# EAGLE design Pure Sequencer (EAGLE 9.6.2)

## Sheet 1 of 5
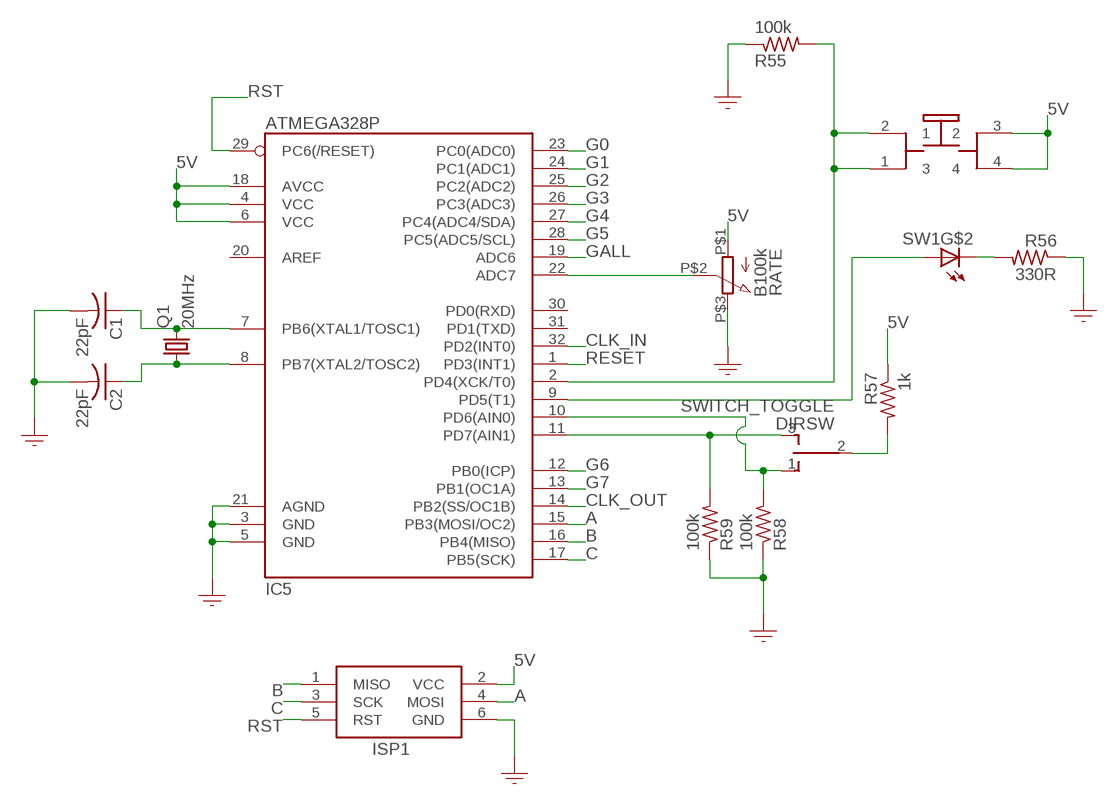
[diagram p0: schematic, sheet 1]

### Parts
C1  22pF  CAPACITOR-USC0805  [C0805]
C2  22pF  CAPACITOR-USC0805  [C0805]
DIRSW  SWITCH_TOGGLE  [TOGGLE_SW]
IC5  ATMEGA328P  MICROPROCESSOR_ATMEGA328_SMT  [TQFP32-08]
ISP1  HEADER2X3-6  [AVRISP]
Q1  20MHz  CRYSTALHC49UP  [HC49UP]
R55  100k  RESISTOR_USR0805  [R0805]
R56  330R  RESISTOR_USR0805  [R0805]
R57  1k  RESISTOR_USR0805  [R0805]
R58  100k  RESISTOR_USR0805  [R0805]
R59  100k  RESISTOR_USR0805  [R0805]
RATE  B100k  RESISTOR_VARIABLE9MM_POT  [POTENTIOMETER_9MM]
SW1  SWITCH_PUSHBUTTON_LED  [PB6149L]

### Nets
5V: IC5.4(VCC) IC5.6(VCC) IC5.18(AVCC) ISP1.2(VCC) R57.1 RATE.P$1 SW1.3 SW1.4 ; also sheet 2,4,5
A: IC5.15(PB3(MOSI/OC2)) ISP1.4(MOSI) ; also sheet 2
B: IC5.16(PB4(MISO)) ISP1.1(MISO) ; also sheet 2
C: IC5.17(PB5(SCK)) ISP1.3(SCK) ; also sheet 2
CLK_IN: IC5.32(PD2(INT0)) ; also sheet 4
CLK_OUT: IC5.14(PB2(SS/OC1B)) ; also sheet 4
G0: IC5.23(PC0(ADC0)) ; also sheet 3
G1: IC5.24(PC1(ADC1)) ; also sheet 3
G2: IC5.25(PC2(ADC2)) ; also sheet 3
G3: IC5.26(PC3(ADC3)) ; also sheet 3
G4: IC5.27(PC4(ADC4/SDA)) ; also sheet 3
G5: IC5.28(PC5(ADC5/SCL)) ; also sheet 3
G6: IC5.12(PB0(ICP)) ; also sheet 3
G7: IC5.13(PB1(OC1A)) ; also sheet 3
GALL: IC5.19(ADC6)
GND: C1.2 C2.2 IC5.3(GND) IC5.5(GND) IC5.21(AGND) ISP1.6(GND) R55.1 R56.1 R58.1 R59.1 RATE.P$3 ; also sheet 2,3,4,5
N$1: C1.1 IC5.7(PB6(XTAL1/TOSC1)) Q1.2
N$2: C2.1 IC5.8(PB7(XTAL2/TOSC2)) Q1.1
N$30: IC5.22(ADC7) RATE.P$2
N$63: IC5.2(PD4(XCK/T0)) R55.2 SW1.1 SW1.2
N$64: IC5.9(PD5(T1)) SW1.A
N$65: R56.2 SW1.K(C)
N$66: DIRSW.2(P) R57.2
N$67: DIRSW.1(O) IC5.10(PD6(AIN0)) R58.2
N$68: DIRSW.3(S) IC5.11(PD7(AIN1)) R59.2
RESET: IC5.1(PD3(INT1)) ; also sheet 4
RST: IC5.29(PC6(/RESET)) ISP1.5(RST)
Unconnected: IC5.20(AREF) IC5.30(PD0(RXD)) IC5.31(PD1(TXD))

## Sheet 2 of 5
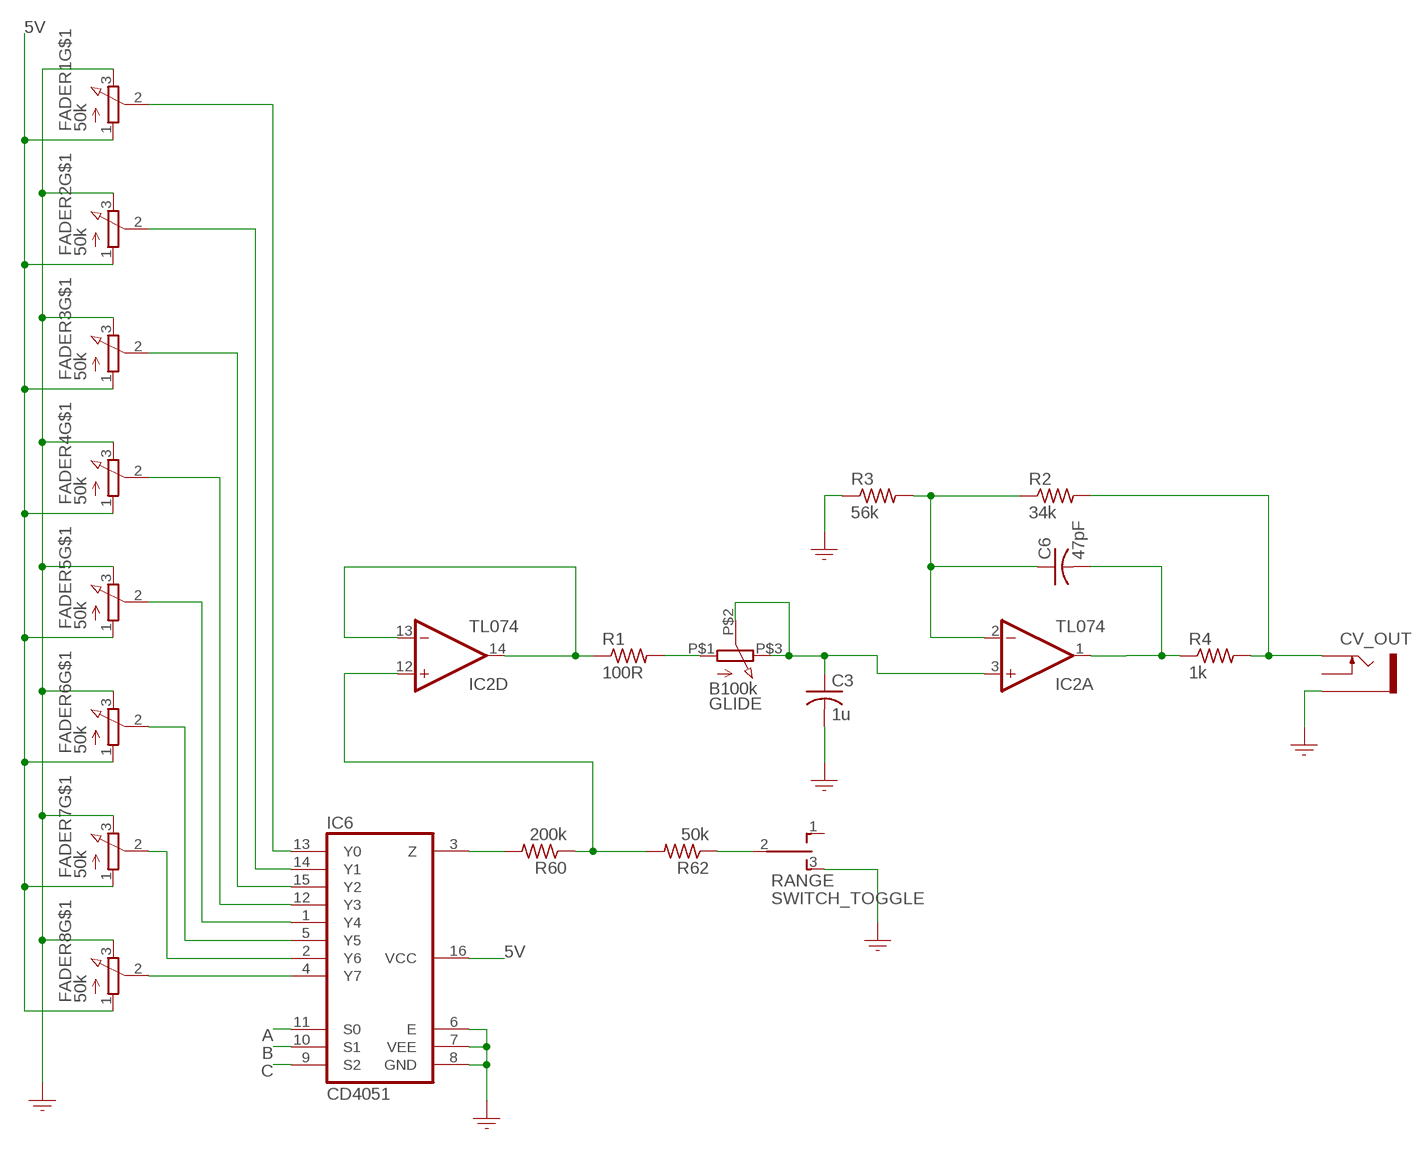
[diagram p1: schematic, sheet 2]

### Parts
C3  1u  CAPACITOR-USC0805  [C0805]
C6  47pF  CAPACITOR-USC0805  [C0805]
CV_OUT  PJ301M-12  SOCKET_MONO_3.5MMPJ301M-12  [PJ301M-12]
FADER1  50k  RESISTOR_VARIABLE_LED  [FADER_20MM_LED]
FADER2  50k  RESISTOR_VARIABLE_LED  [FADER_20MM_LED]
FADER3  50k  RESISTOR_VARIABLE_LED  [FADER_20MM_LED]
FADER4  50k  RESISTOR_VARIABLE_LED  [FADER_20MM_LED]
FADER5  50k  RESISTOR_VARIABLE_LED  [FADER_20MM_LED]
FADER6  50k  RESISTOR_VARIABLE_LED  [FADER_20MM_LED]
FADER7  50k  RESISTOR_VARIABLE_LED  [FADER_20MM_LED]
FADER8  50k  RESISTOR_VARIABLE_LED  [FADER_20MM_LED]
GLIDE  B100k  RESISTOR_VARIABLE9MM_POT  [POTENTIOMETER_9MM]
IC2  TL074  OPAMP_QUADD  [SO14]
IC6  CD4051  MUX_1X8_CD4051  [SOIC_16]
R1  100R  RESISTOR_USR0805  [R0805]
R2  34k  RESISTOR_USR0805  [R0805]
R3  56k  RESISTOR_USR0805  [R0805]
R4  1k  RESISTOR_USR0805  [R0805]
R60  200k  RESISTOR_USR0805  [R0805]
R62  50k  RESISTOR_USR0805  [R0805]
RANGE  SWITCH_TOGGLE  [TOGGLE_SW]

### Nets
5V: FADER1.1 FADER2.1 FADER3.1 FADER4.1 FADER5.1 FADER6.1 FADER7.1 FADER8.1 IC6.16(VCC) ; also sheet 1,4,5
A: IC6.11(S0) ; also sheet 1
B: IC6.10(S1) ; also sheet 1
C: IC6.9(S2) ; also sheet 1
GND: C3.2 CV_OUT.GND(SLEEVE) FADER1.3 FADER2.3 FADER3.3 FADER4.3 FADER5.3 FADER6.3 FADER7.3 FADER8.3 IC6.6(E) IC6.7(VEE) IC6.8(GND) R3.1 RANGE.3(S) ; also sheet 1,3,4,5
N$3: IC2.12(D:+IN) R60.1 R62.2
N$4: IC2.13(D:-IN) IC2.14(D:OUT) R1.1
N$5: GLIDE.P$1 R1.2
N$6: FADER8.2 IC6.4(Y7)
N$7: FADER7.2 IC6.2(Y6)
N$8: FADER6.2 IC6.5(Y5)
N$11: FADER5.2 IC6.1(Y4)
N$12: FADER4.2 IC6.12(Y3)
N$13: FADER3.2 IC6.15(Y2)
N$14: FADER2.2 IC6.14(Y1)
N$15: FADER1.2 IC6.13(Y0)
N$16: C3.1 GLIDE.P$2 GLIDE.P$3 IC2.3(A:+IN)
N$19: C6.1 IC2.2(A:-IN) R2.1 R3.2
N$20: C6.2 IC2.1(A:OUT) R4.1
N$21: CV_OUT.TIP R2.2 R4.2
N$69: IC6.3(Z) R60.2
N$70: R62.1 RANGE.2(P)
Unconnected: CV_OUT.NORM(SWITCH) RANGE.1(O)

## Sheet 3 of 5
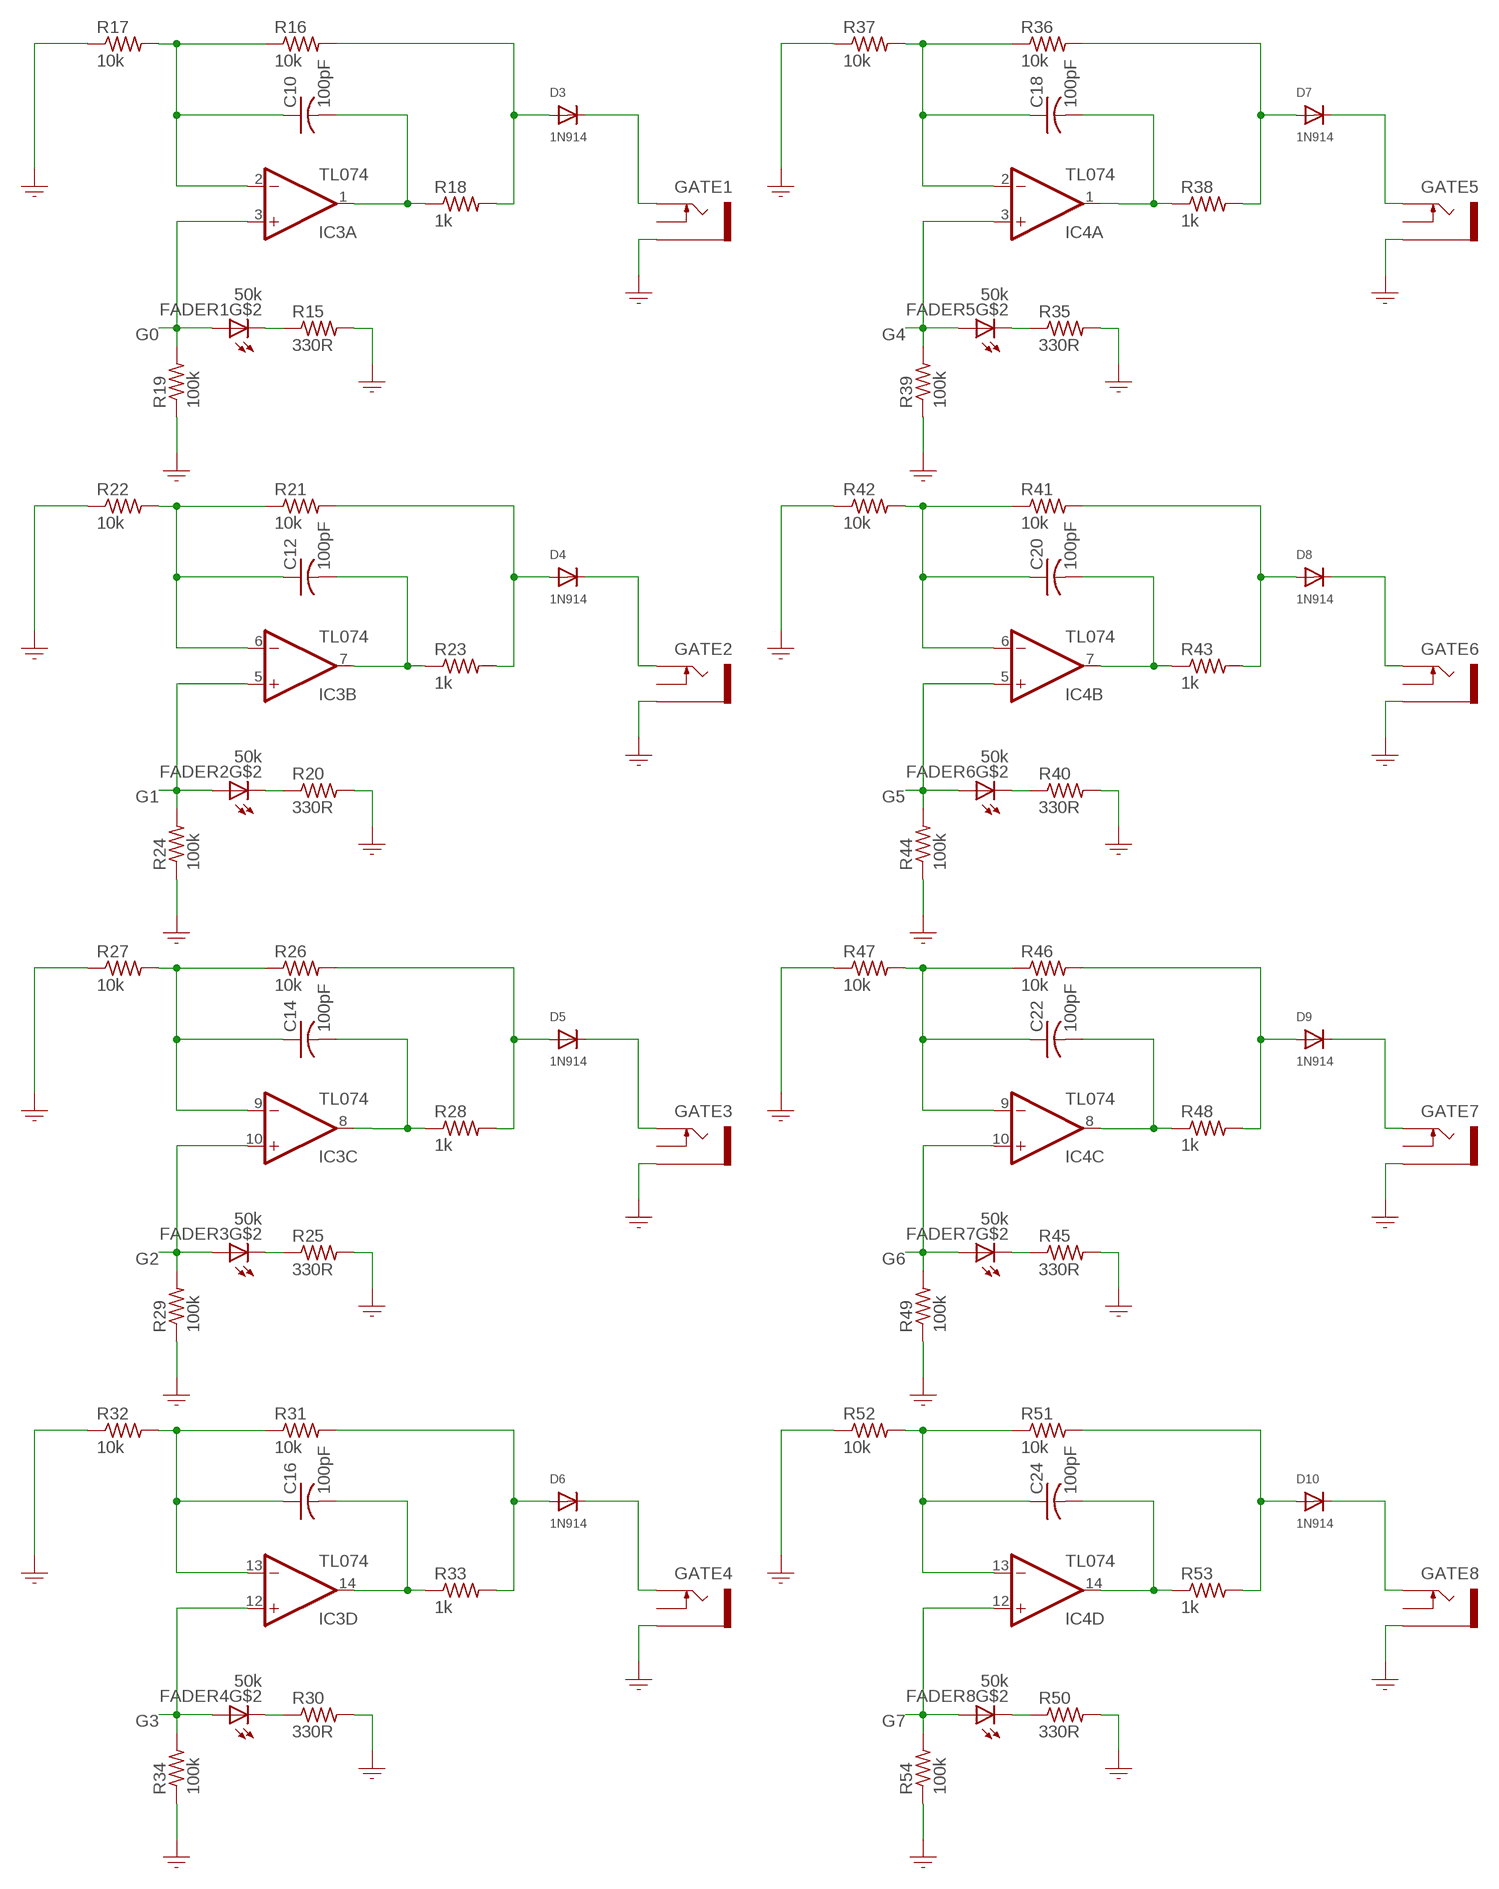
[diagram p2: schematic, sheet 3]

### Parts
C10  100pF  CAPACITOR-USC0805  [C0805]
C12  100pF  CAPACITOR-USC0805  [C0805]
C14  100pF  CAPACITOR-USC0805  [C0805]
C16  100pF  CAPACITOR-USC0805  [C0805]
C18  100pF  CAPACITOR-USC0805  [C0805]
C20  100pF  CAPACITOR-USC0805  [C0805]
C22  100pF  CAPACITOR-USC0805  [C0805]
C24  100pF  CAPACITOR-USC0805  [C0805]
D3  1N914  DIODEDO-41  [DO-41]
D4  1N914  DIODEDO-41  [DO-41]
D5  1N914  DIODEDO-41  [DO-41]
D6  1N914  DIODEDO-41  [DO-41]
D7  1N914  DIODEDO-41  [DO-41]
D8  1N914  DIODEDO-41  [DO-41]
D9  1N914  DIODEDO-41  [DO-41]
D10  1N914  DIODEDO-41  [DO-41]
GATE1  PJ301M-12  SOCKET_MONO_3.5MMPJ301M-12  [PJ301M-12]
GATE2  PJ301M-12  SOCKET_MONO_3.5MMPJ301M-12  [PJ301M-12]
GATE3  PJ301M-12  SOCKET_MONO_3.5MMPJ301M-12  [PJ301M-12]
GATE4  PJ301M-12  SOCKET_MONO_3.5MMPJ301M-12  [PJ301M-12]
GATE5  PJ301M-12  SOCKET_MONO_3.5MMPJ301M-12  [PJ301M-12]
GATE6  PJ301M-12  SOCKET_MONO_3.5MMPJ301M-12  [PJ301M-12]
GATE7  PJ301M-12  SOCKET_MONO_3.5MMPJ301M-12  [PJ301M-12]
GATE8  PJ301M-12  SOCKET_MONO_3.5MMPJ301M-12  [PJ301M-12]
IC3  TL074  OPAMP_QUADD  [SO14]
IC4  TL074  OPAMP_QUADD  [SO14]
R15  330R  RESISTOR_USR0805  [R0805]
R16  10k  RESISTOR_USR0805  [R0805]
R17  10k  RESISTOR_USR0805  [R0805]
R18  1k  RESISTOR_USR0805  [R0805]
R19  100k  RESISTOR_USR0805  [R0805]
R20  330R  RESISTOR_USR0805  [R0805]
R21  10k  RESISTOR_USR0805  [R0805]
R22  10k  RESISTOR_USR0805  [R0805]
R23  1k  RESISTOR_USR0805  [R0805]
R24  100k  RESISTOR_USR0805  [R0805]
R25  330R  RESISTOR_USR0805  [R0805]
R26  10k  RESISTOR_USR0805  [R0805]
R27  10k  RESISTOR_USR0805  [R0805]
R28  1k  RESISTOR_USR0805  [R0805]
R29  100k  RESISTOR_USR0805  [R0805]
R30  330R  RESISTOR_USR0805  [R0805]
R31  10k  RESISTOR_USR0805  [R0805]
R32  10k  RESISTOR_USR0805  [R0805]
R33  1k  RESISTOR_USR0805  [R0805]
R34  100k  RESISTOR_USR0805  [R0805]
R35  330R  RESISTOR_USR0805  [R0805]
R36  10k  RESISTOR_USR0805  [R0805]
R37  10k  RESISTOR_USR0805  [R0805]
R38  1k  RESISTOR_USR0805  [R0805]
R39  100k  RESISTOR_USR0805  [R0805]
R40  330R  RESISTOR_USR0805  [R0805]
R41  10k  RESISTOR_USR0805  [R0805]
R42  10k  RESISTOR_USR0805  [R0805]
R43  1k  RESISTOR_USR0805  [R0805]
R44  100k  RESISTOR_USR0805  [R0805]
R45  330R  RESISTOR_USR0805  [R0805]
R46  10k  RESISTOR_USR0805  [R0805]
R47  10k  RESISTOR_USR0805  [R0805]
R48  1k  RESISTOR_USR0805  [R0805]
R49  100k  RESISTOR_USR0805  [R0805]
R50  330R  RESISTOR_USR0805  [R0805]
R51  10k  RESISTOR_USR0805  [R0805]
R52  10k  RESISTOR_USR0805  [R0805]
R53  1k  RESISTOR_USR0805  [R0805]
R54  100k  RESISTOR_USR0805  [R0805]

### Nets
G0: FADER1.A IC3.3(A:+IN) R19.2 ; also sheet 1
G1: FADER2.A IC3.5(B:+IN) R24.2 ; also sheet 1
G2: FADER3.A IC3.10(C:+IN) R29.2 ; also sheet 1
G3: FADER4.A IC3.12(D:+IN) R34.2 ; also sheet 1
G4: FADER5.A IC4.3(A:+IN) R39.2 ; also sheet 1
G5: FADER6.A IC4.5(B:+IN) R44.2 ; also sheet 1
G6: FADER7.A IC4.10(C:+IN) R49.2 ; also sheet 1
G7: FADER8.A IC4.12(D:+IN) R54.2 ; also sheet 1
GND: GATE1.GND(SLEEVE) GATE2.GND(SLEEVE) GATE3.GND(SLEEVE) GATE4.GND(SLEEVE) GATE5.GND(SLEEVE) GATE6.GND(SLEEVE) GATE7.GND(SLEEVE) GATE8.GND(SLEEVE) R15.2 R17.1 R19.1 R20.2 R22.1 R24.1 R25.2 R27.1 R29.1 R30.2 R32.1 R34.1 R35.2 R37.1 R39.1 R40.2 R42.1 R44.1 R45.2 R47.1 R49.1 R50.2 R52.1 R54.1 ; also sheet 1,2,4,5
N$31: FADER1.K(C) R15.1
N$32: C10.1 IC3.2(A:-IN) R16.1 R17.2
N$33: C10.2 IC3.1(A:OUT) R18.1
N$34: D3.A R16.2 R18.2
N$35: FADER3.K(C) R25.1
N$36: FADER2.K(C) R20.1
N$37: C12.1 IC3.6(B:-IN) R21.1 R22.2
N$38: C12.2 IC3.7(B:OUT) R23.1
N$39: D4.A R21.2 R23.2
N$40: C14.1 IC3.9(C:-IN) R26.1 R27.2
N$41: C14.2 IC3.8(C:OUT) R28.1
N$42: D5.A R26.2 R28.2
N$43: FADER4.K(C) R30.1
N$44: C16.1 IC3.13(D:-IN) R31.1 R32.2
N$45: C16.2 IC3.14(D:OUT) R33.1
N$46: D6.A R31.2 R33.2
N$47: FADER5.K(C) R35.1
N$48: C18.1 IC4.2(A:-IN) R36.1 R37.2
N$49: C18.2 IC4.1(A:OUT) R38.1
N$50: D7.A R36.2 R38.2
N$51: FADER6.K(C) R40.1
N$52: C20.1 IC4.6(B:-IN) R41.1 R42.2
N$53: C20.2 IC4.7(B:OUT) R43.1
N$54: D8.A R41.2 R43.2
N$55: FADER7.K(C) R45.1
N$56: C22.1 IC4.9(C:-IN) R46.1 R47.2
N$57: C22.2 IC4.8(C:OUT) R48.1
N$58: D9.A R46.2 R48.2
N$59: FADER8.K(C) R50.1
N$60: C24.1 IC4.13(D:-IN) R51.1 R52.2
N$61: C24.2 IC4.14(D:OUT) R53.1
N$62: D10.A R51.2 R53.2
N$71: D6.C GATE4.TIP
N$72: D5.C GATE3.TIP
N$73: D4.C GATE2.TIP
N$74: D3.C GATE1.TIP
N$75: D10.C GATE8.TIP
N$76: D9.C GATE7.TIP
N$77: D8.C GATE6.TIP
N$78: D7.C GATE5.TIP
Unconnected: GATE1.NORM(SWITCH) GATE2.NORM(SWITCH) GATE3.NORM(SWITCH) GATE4.NORM(SWITCH) GATE5.NORM(SWITCH) GATE6.NORM(SWITCH) GATE7.NORM(SWITCH) GATE8.NORM(SWITCH)

## Sheet 4 of 5
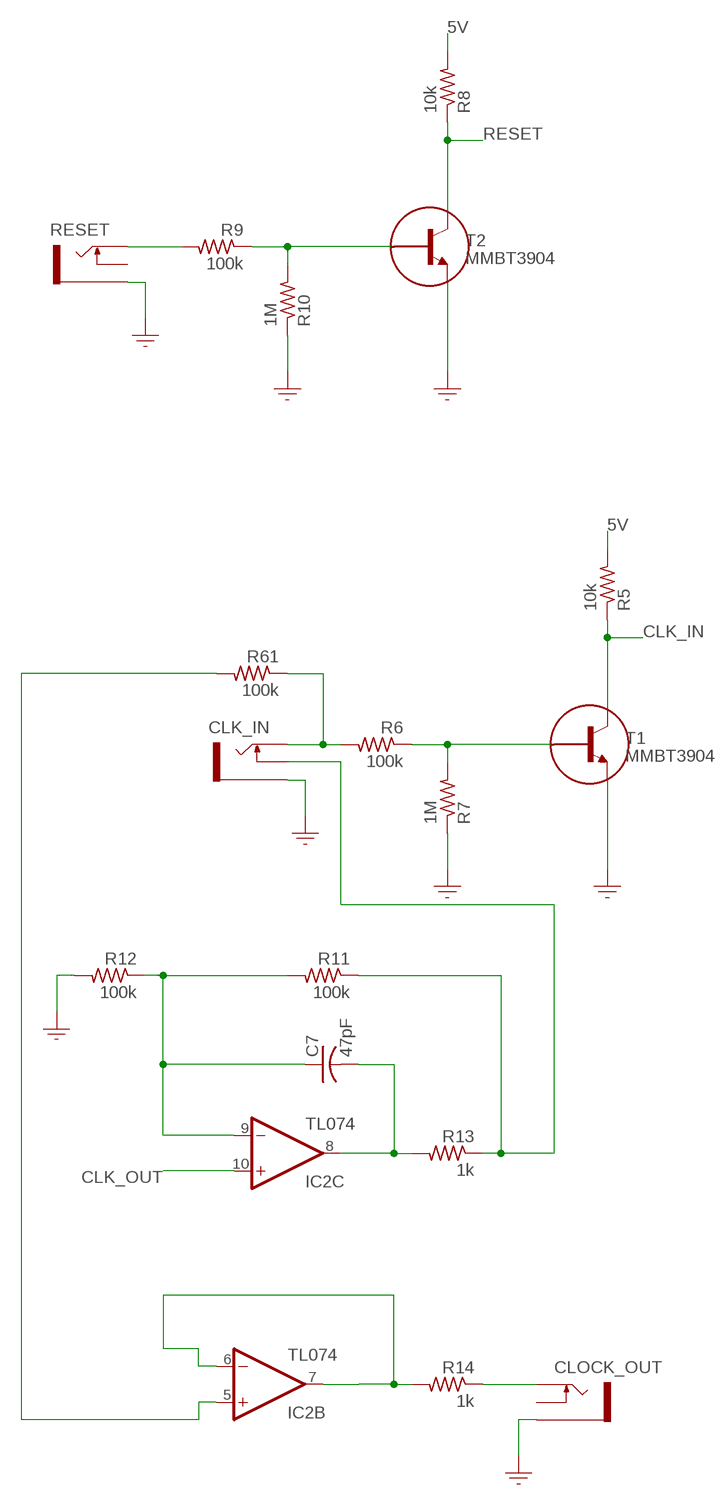
[diagram p3: schematic, sheet 4]

### Parts
C7  47pF  CAPACITOR-USC0805  [C0805]
CLK_IN  PJ301M-12  SOCKET_MONO_3.5MMPJ301M-12  [PJ301M-12]
CLOCK_OUT  PJ301M-12  SOCKET_MONO_3.5MMPJ301M-12  [PJ301M-12]
R5  10k  RESISTOR_USR0805  [R0805]
R6  100k  RESISTOR_USR0805  [R0805]
R7  1M  RESISTOR_USR0805  [R0805]
R8  10k  RESISTOR_USR0805  [R0805]
R9  100k  RESISTOR_USR0805  [R0805]
R10  1M  RESISTOR_USR0805  [R0805]
R11  100k  RESISTOR_USR0805  [R0805]
R12  100k  RESISTOR_USR0805  [R0805]
R13  1k  RESISTOR_USR0805  [R0805]
R14  1k  RESISTOR_USR0805  [R0805]
R61  100k  RESISTOR_USR0805  [R0805]
RESET  PJ301M-12  SOCKET_MONO_3.5MMPJ301M-12  [PJ301M-12]
T1  MMBT3904  TRANSISTOR_NPNSOT23  [SOT23]
T2  MMBT3904  TRANSISTOR_NPNSOT23  [SOT23]

### Nets
5V: R5.2 R8.2 ; also sheet 1,2,5
CLK_IN: R5.1 T1.3(C) ; also sheet 1
CLK_OUT: IC2.10(C:+IN) ; also sheet 1
GND: CLK_IN.GND(SLEEVE) CLOCK_OUT.GND(SLEEVE) R7.1 R10.1 R12.2 RESET.GND(SLEEVE) T1.2(E) T2.2(E) ; also sheet 1,2,3,5
N$17: R6.1 R7.2 T1.1(B)
N$18: IC2.5(B:+IN) R61.2
N$22: R9.1 R10.2 T2.1(B)
N$23: R9.2 RESET.TIP
N$24: C7.1 IC2.9(C:-IN) R11.2 R12.1
N$25: C7.2 IC2.8(C:OUT) R13.2
N$26: CLK_IN.TIP R6.2 R61.1
N$27: IC2.6(B:-IN) IC2.7(B:OUT) R14.2
N$28: CLOCK_OUT.TIP R14.1
N$29: CLK_IN.NORM(SWITCH) R11.1 R13.1
RESET: R8.1 T2.3(C) ; also sheet 1
Unconnected: CLOCK_OUT.NORM(SWITCH) RESET.NORM(SWITCH)

## Sheet 5 of 5
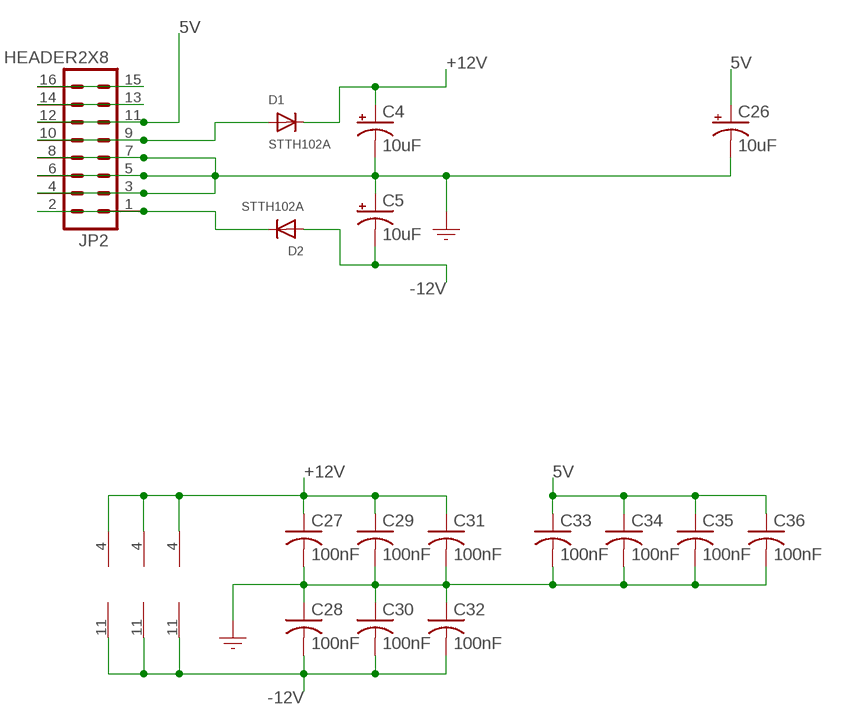
[diagram p4: schematic, sheet 5]

### Parts
C4  10uF  CAPACITOR_POL-US153CLV-0505  [153CLV-0505]
C5  10uF  CAPACITOR_POL-US153CLV-0505  [153CLV-0505]
C26  10uF  CAPACITOR_POL-US153CLV-0505  [153CLV-0505]
C27  100nF  CAPACITOR-USC0805  [C0805]
C28  100nF  CAPACITOR-USC0805  [C0805]
C29  100nF  CAPACITOR-USC0805  [C0805]
C30  100nF  CAPACITOR-USC0805  [C0805]
C31  100nF  CAPACITOR-USC0805  [C0805]
C32  100nF  CAPACITOR-USC0805  [C0805]
C33  100nF  CAPACITOR-USC0805  [C0805]
C34  100nF  CAPACITOR-USC0805  [C0805]
C35  100nF  CAPACITOR-USC0805  [C0805]
C36  100nF  CAPACITOR-USC0805  [C0805]
D1  STTH102A  DIODESMA  [SMADIODE]
D2  STTH102A  DIODESMA  [SMADIODE]
JP2  HEADER2X8  [POWER_SHROUDED]

### Nets
5V: C26.+ C33.1 C34.1 C35.1 C36.1 JP2.11 JP2.12 ; also sheet 1,2,4
+12V: C4.+ C27.1 C29.1 C31.1 D1.C IC2.4(P:V+) IC3.4(P:V+) IC4.4(P:V+)
-12V: C5.- C28.2 C30.2 C32.2 D2.A IC2.11(P:V-) IC3.11(P:V-) IC4.11(P:V-)
GND: C4.- C5.+ C26.- C27.2 C28.1 C29.2 C30.1 C31.2 C32.1 C33.2 C34.2 C35.2 C36.2 JP2.3 JP2.4 JP2.5 JP2.6 JP2.7 JP2.8 ; also sheet 1,2,3,4
N$9: D1.A JP2.9 JP2.10
N$79: D2.C JP2.1 JP2.2
N$81: JP2.13 JP2.14
N$82: JP2.15 JP2.16

## Library data of the parts
C1-C3 C6 C7 C10 C12 C14 C16 C18 C20 C22 C24 C27-C36 = GMSN:CAPACITOR-US: Capacitor; SORT: 3
C4 C5 C26 = GMSN:CAPACITOR_POL-US: Electro Capacitor; SORT: 6
CLK_IN CLOCK_OUT CV_OUT GATE1-GATE8 RESET = GMSN:SOCKET_MONO_3.5MM: 3.5 mm Jack Socket; SORT: 8
D1-D10 = GMSN:DIODE: Diode SMADIODE - SMA Surface Mount Package 20V 1A Schottky Diode Digikey: 641-1014-6-ND DO-1N4148 - Through Hole Small Current Diode SOD-123 20V 1 A (.5mV Vf) Schottky Diode - Digikey: MBRX120TPMSCT-ND SOD-323 10V 570mA (.38mV Vf, 3ns) Schottky Diode - Digikey: ZLLS410CT-ND SOD-523 30V 30mA Schottky Diode (RB751S-40TE61) - Digikey: RB751S-40TE61CT-ND SOT23-R/W - SOT23 Package (R = Solder Paste/Reflow Ovens, W = Hand-Soldering) BAT54Film 40V 300mA - Digikey: 497-7162-1-ND; SORT: 1
DIRSW RANGE = GMSN:SWITCH_TOGGLE: On-Off-On Switch; SORT: 9
FADER1-FADER8 = GMSN:RESISTOR_VARIABLE_LED: Potentiometer with LED; SORT: 7
GLIDE RATE = GMSN:RESISTOR_VARIABLE: Potentiometer; SORT: 8
IC2-IC4 = GMSN:OPAMP_QUAD: OP AMP; SORT: 4
IC5 = GMSN:MICROPROCESSOR_ATMEGA328_SMT: 32-Pin ATMEGA328 Commonly used on Arduino compatible boards Available in QFP and QFN packages TQFP is IC-09069 QFN is non-stock; SORT: 4
IC6 = GMSN:MUX_1X8_CD4051: Multiplexer / Demultiplexer; SORT: 4
ISP1 = GMSN:HEADER2X3: AVR ISP Header Standard 6 pin header for AVR programming; SORT: 7
JP2 = GMSN:HEADER2X8: 16 Pin Header 2x8; SORT: 7
Q1 = GMSN:CRYSTAL: Crystal; SORT: 5
R1-R62 = GMSN:RESISTOR_US: Resistor; SORT: 2
SW1 = GMSN:SWITCH_PUSHBUTTON_LED: Pushbutton LED; SORT: 9
T1 T2 = GMSN:TRANSISTOR_NPN: Generic NPN BJT MMBT2222A - TRANS-08049 (SOT-23, 1A 40V) MPSA42 - TRANS-09116 (SOT-23, 500mA 300V) MMBT5088LT1G - TRANS-11160 (SOT-23, 50 mA 30V); SORT: 4

## Board
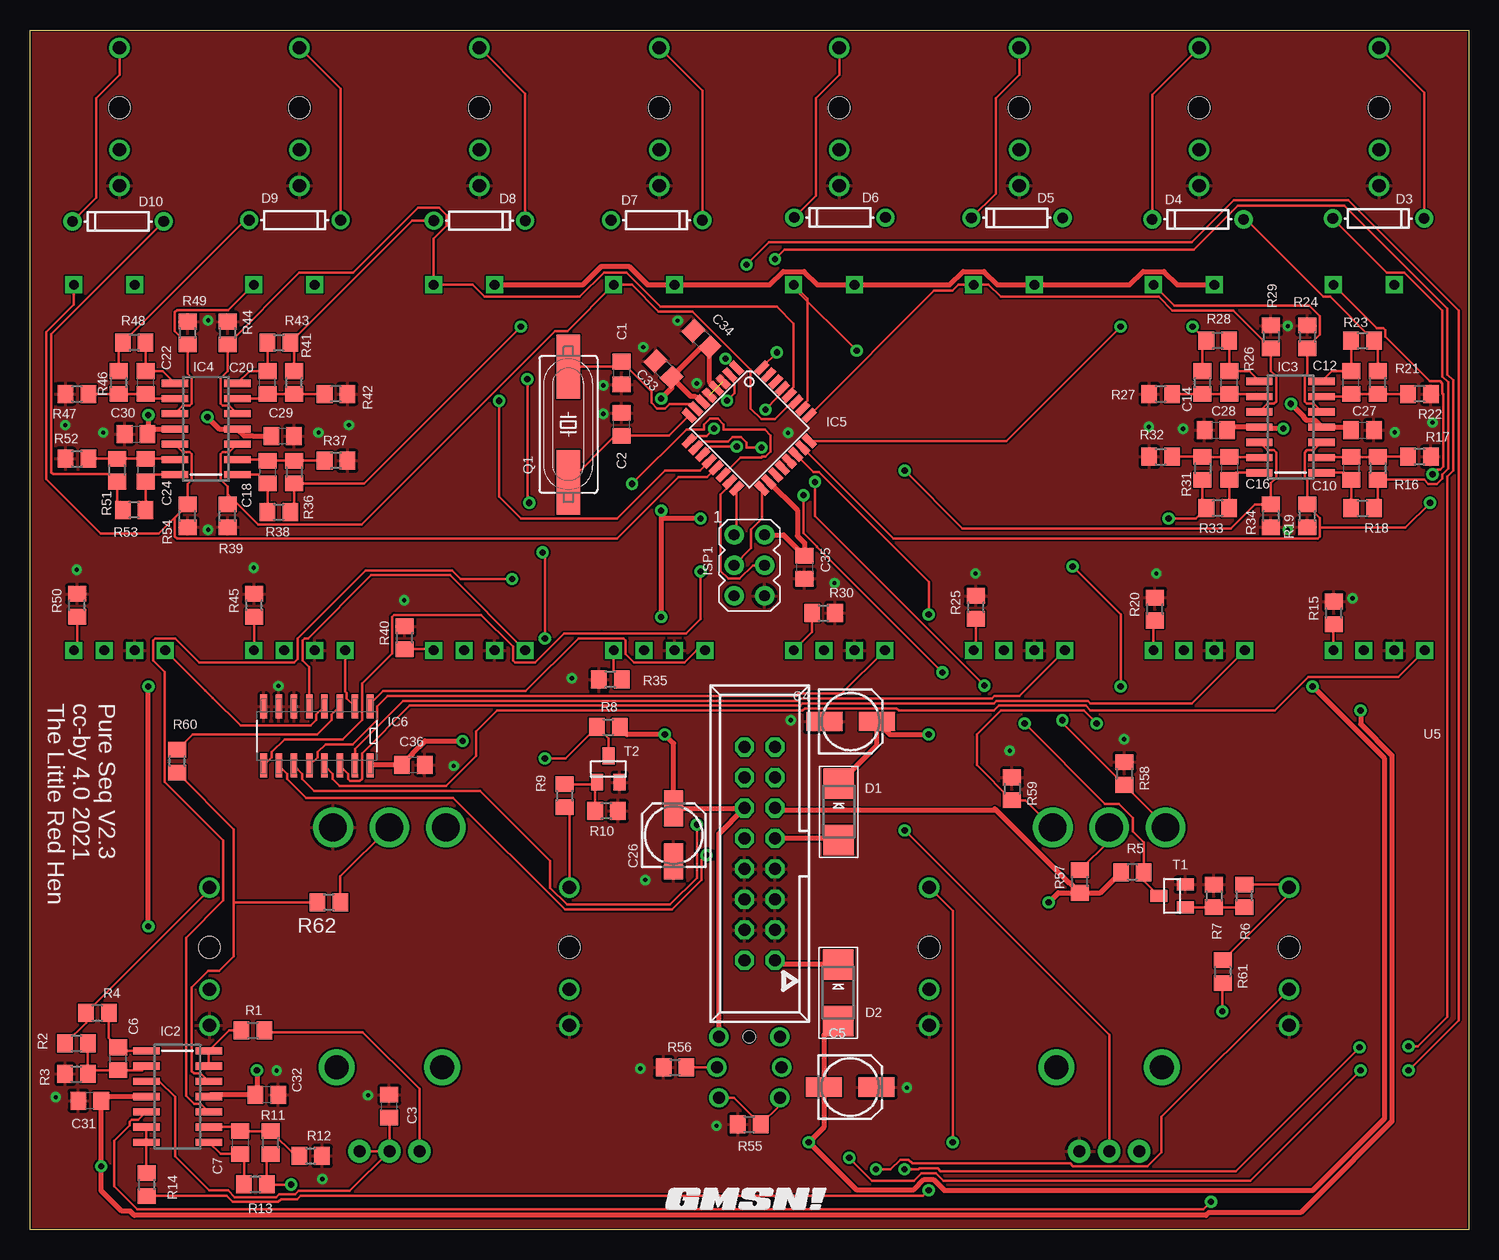
[diagram p5: board, top side]
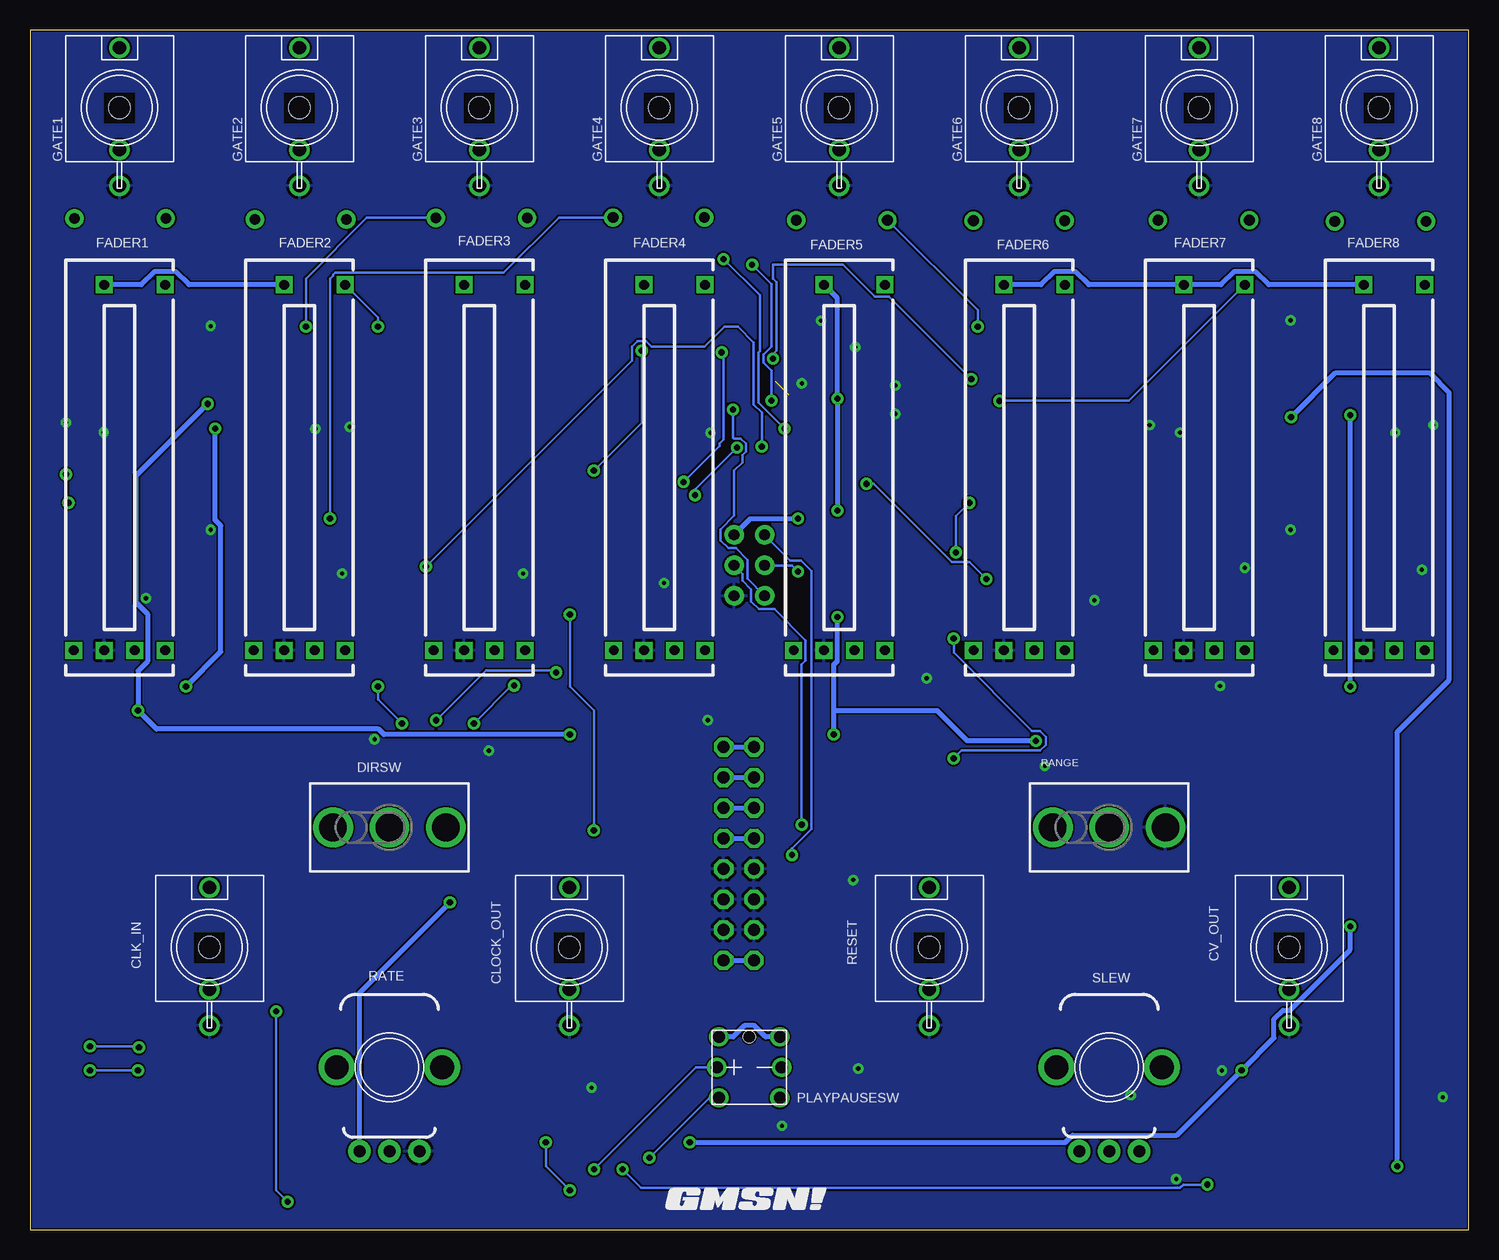
[diagram p6: board, bottom side, seen from below]

Size 119.92 x 100 mm. Coordinates in mm from the lower left corner, seen from the top.
Outline: 119.92,0 0,0 0,100 119.92,100 119.92,0
Copper layers (1*16): Top 0.035mm / dielectric 1.5mm / Bottom 0.035mm
Design rules "PCBWay": minimum track width 6mil, minimum drill 12mil, track to track 6mil, track to pad 6mil, pad to pad 6mil, via to via 6mil, smd to smd 6mil, copper to edge 6mil, drill to drill 6mil, minimum pad ring 12mil, minimum via ring 10mil, stop-mask expansion 4mil, vias tented up to drill 25mil, thermal gap 10mil

### Footprints (pad centres in the part's own frame; a part is rotated, then mirrored left to right if it is on the bottom)
C0805 = smd 1.3 x 1.5: 1 -0.95,0; 2 0.95,0
153CLV-0505 = smd 3 x 1.6: + 2.2,0; - -2.2,0
PJ301M-12 = drill 1.1: GND 0,-6.5; NORM 0,-3.5; TIP 0,5 | hole 1.778: 0,0
SMADIODE = smd 2.54 x 2.54: A 2.349,0; C -2.349,0
DO-41 = drill 0.9: A -3.81,0; C 3.81,0
TOGGLE_SW = drill 2.3: 1 -4.7,0; 2 0,0; 3 4.7,0
FADER_20MM_LED = drill 0.8 square: 1 -1.27,15.24; 2 -3.81,-15.24; 3 -1.27,-15.24; A 3.81,15.24; K 3.81,-15.24; P$3 1.27,-15.24
POTENTIOMETER_9MM = drill 1 pad 1.88: P$1 -2.5,-7; P$2 0,-7; P$3 2.5,-7 | drill 2 pad 2.68: P$4 -4.4,0; P$5 4.4,0
SO14 = smd 0.6 x 2.2: 1 -3.81,-2.6; 2 -2.54,-2.6; 3 -1.27,-2.6; 4 0,-2.6; 5 1.27,-2.6; 6 2.54,-2.6; 7 3.81,-2.6; 8 3.81,2.6; 9 2.54,2.6; 10 1.27,2.6; 11 0,2.6; 12 -1.27,2.6; 13 -2.54,2.6; 14 -3.81,2.6
TQFP32-08 = smd 1.27 x 0.559: 1 -4.293,2.8; 2 -4.293,2; 3 -4.293,1.2; 4 -4.293,0.4; 5 -4.293,-0.4; 6 -4.293,-1.2; 7 -4.293,-2; 8 -4.293,-2.8; 17 4.293,-2.8; 18 4.293,-2; 19 4.293,-1.2; 20 4.293,-0.4; 21 4.293,0.4; 22 4.293,1.2; 23 4.293,2; 24 4.293,2.8 | smd 0.559 x 1.27: 9 -2.8,-4.293; 10 -2,-4.293; 11 -1.2,-4.293; 12 -0.4,-4.293; 13 0.4,-4.293; 14 1.2,-4.293; 15 2,-4.293; 16 2.8,-4.293; 25 2.8,4.293; 26 2,4.293; 27 1.2,4.293; 28 0.4,4.293; 29 -0.4,4.293; 30 -1.2,4.293; 31 -2,4.293; 32 -2.8,4.293
SOIC_16 = smd 1.981 x 0.559: 1 -2.464,4.445; 2 -2.464,3.175; 3 -2.464,1.905; 4 -2.464,0.635; 5 -2.464,-0.635; 6 -2.464,-1.905; 7 -2.464,-3.175; 8 -2.464,-4.445; 9 2.464,-4.445; 10 2.464,-3.175; 11 2.464,-1.905; 12 2.464,-0.635; 13 2.464,0.635; 14 2.464,1.905; 15 2.464,3.175; 16 2.464,4.445
AVRISP = drill 0.9 pad 1.626: 1 -1.27,2.54; 2 1.27,2.54; 3 -1.27,0; 4 1.27,0; 5 -1.27,-2.54; 6 1.27,-2.54
POWER_SHROUDED = drill 1 octagon: 1 -8.89,-1.27; 2 -8.89,1.27; 3 -6.35,-1.27; 4 -6.35,1.27; 5 -3.81,-1.27; 6 -3.81,1.27; 7 -1.27,-1.27; 8 -1.27,1.27; 9 1.27,-1.27; 10 1.27,1.27; 11 3.81,-1.27; 12 3.81,1.27; 13 6.35,-1.27; 14 6.35,1.27; 15 8.89,-1.27; 16 8.89,1.27
HC49UP = smd 5.334 x 1.93: 1 -4.826,0; 2 4.826,0
R0805 = smd 1.3 x 1.5: 1 -0.95,0; 2 0.95,0
PB6149L = drill 1: 1 2.54,-2.54; 2 2.54,2.54; 3 -2.54,-2.54; 4 -2.54,2.54; A 0,-2.7; K 0,2.7 | hole 1: -2.54,0
SOT23 = smd 1 x 1.4: 1 -0.95,-1.1; 2 0.95,-1.1; 3 0,1.1

### Placement (x,y rotation side)
C1  49.32,71.4 270 top
C2  49.32,67.12 90 top
C3  29.96,10.29 90 top
C4  68.41,42.35 0 top
C5  68.37,11.87 0 top
C6  7.37,14.23 90 top
C7  17.53,7.25 270 top
C10  110.12,63.47 270 top
C12  110.12,70.61 90 top
C14  99.97,70.61 90 top
C16  99.97,63.47 270 top
C18  19.8,63.15 270 top
C20  19.8,70.61 90 top
C22  9.64,70.61 90 top
C24  9.64,63.31 270 top
C26  53.66,32.88 90 top
C27  111.08,66.64 0 top
C28  98.85,66.64 0 top
C29  21.07,66.16 0 top
C30  8.84,66.32 0 top
C31  4.98,10.74 180 top
C32  19.75,11.22 180 top
C33  52.82,71.72 135 top
C34  55.99,74.26 135 top
C35  64.56,55.21 270 top
C36  31.96,38.75 0 top
CLK_IN  104.96,23.52 0 bottom
CLOCK_OUT  74.96,23.52 0 bottom
CV_OUT  14.96,23.52 0 bottom
D1  67.43,34.83 270 top
D2  67.37,19.74 270 top
D3  112.41,84.29 0 top
D4  97.36,84.21 180 top
D5  82.28,84.34 180 top
D6  67.51,84.37 180 top
D7  52.24,84.14 0 top
D8  37.48,84.11 0 top
D9  22.08,84.14 0 top
D10  7.35,84.04 180 top
DIRSW  89.96,33.52 0 bottom
FADER1  112.46,63.52 0 bottom
FADER2  97.46,63.52 0 bottom
FADER3  82.46,63.52 0 bottom
FADER4  67.46,63.52 0 bottom
FADER5  52.46,63.52 0 bottom
FADER6  37.46,63.52 0 bottom
FADER7  22.46,63.52 0 bottom
FADER8  7.46,63.52 0 bottom
GATE1  112.46,93.52 0 bottom
GATE2  97.46,93.52 0 bottom
GATE3  82.46,93.52 0 bottom
GATE4  67.46,93.52 0 bottom
GATE5  52.46,93.52 0 bottom
GATE6  37.46,93.52 0 bottom
GATE7  22.46,93.52 0 bottom
GATE8  7.46,93.52 0 bottom
GLIDE  29.96,13.52 0 bottom
IC2  12.3,11.08 270 top
IC3  105.08,66.9 90 top
IC4  14.68,66.74 90 top
IC5  59.96,66.8 315 top
IC6  23.92,41.14 270 top
ISP1  59.96,55.37 0 top
JP2  60.83,31.33 90 top
Q1  44.88,67.12 90 top
R1  18.58,16.6 0 top
R2  3.87,15.5 180 top
R3  3.87,12.96 0 top
R4  5.62,18.04 180 top
R5  91.9,29.78 180 top
R6  101.23,27.81 90 top
R7  98.7,27.81 270 top
R8  48.21,41.88 0 top
R9  44.56,36.16 270 top
R10  48.05,34.89 180 top
R11  20.07,7.25 90 top
R12  23.4,6.14 0 top
R13  18.8,3.76 180 top
R14  9.75,3.76 90 top
R15  108.7,51.4 90 top
R16  112.35,63.47 270 top
R17  115.84,64.42 180 top
R18  111.08,60.13 0 top
R19  106.47,59.5 90 top
R20  93.77,51.72 90 top
R21  112.35,70.61 90 top
R22  115.84,69.66 180 top
R23  111.08,74.1 0 top
R24  106.47,74.42 270 top
R25  78.85,51.88 90 top
R26  97.74,70.61 90 top
R27  94.25,69.66 0 top
R28  99.01,74.1 180 top
R29  103.46,74.42 270 top
R30  66.15,51.4 0 top
R31  97.74,63.47 270 top
R32  94.25,64.42 0 top
R33  99.01,60.13 180 top
R34  103.46,59.5 90 top
R35  48.37,45.84 180 top
R36  22.02,63.15 270 top
R37  25.51,64.1 180 top
R38  20.75,59.81 0 top
R39  16.46,59.5 90 top
R40  31.23,49.34 90 top
R41  22.02,70.61 90 top
R42  25.51,69.66 180 top
R43  20.75,73.94 0 top
R44  16.46,74.74 270 top
R45  18.69,52.04 90 top
R46  7.41,70.61 90 top
R47  3.92,69.66 0 top
R48  8.68,73.94 180 top
R49  13.13,74.74 270 top
R50  3.92,52.04 90 top
R51  7.26,63.31 270 top
R52  3.92,64.26 0 top
R53  8.68,59.97 180 top
R54  13.13,59.5 90 top
R55  59.96,8.76 0 top
R56  53.77,13.52 0 top
R57  87.52,29.02 90 top
R58  91.23,38.01 270 top
R59  81.87,36.74 270 top
R60  12.28,39.04 90 top
R61  99.42,21.5 270 top
R62  24.92,27.27 180 top
RANGE  29.96,33.52 0 bottom
RATE  89.96,13.52 0 bottom
RESET  44.96,23.52 0 bottom
SW1  59.96,13.52 270 bottom
T1  95.2,27.81 90 top
T2  48.21,38.38 0 top
U$1  [GMSN!_LOGO]  59.96,2.48 0 bottom
U$2  [GMSN!_LOGO]  59.96,2.48 0 top

### Tracks (layer width: path | path; a pad name or v marks a point on that pad's centre or on a via)
5V  (via drill 0.51)
  Top 0.406: C26.+ | C26.+ 53.66,40.53 v52.92,41.27 49.77,41.27 R8.2 | C33.1 53.49,70.14 v52.62,69.27 | C33.1 56.03,73.59 C34.1 56.66,70.66 IC5.4 | IC5.6 55.92,68.99 55.43,69.47 55.06,69.47 C33.1 | ISP1.2 62.82,57.91 C35.1 64.56,57.24 63.97,57.83 63.97,59.96 IC5.18 | R57.1 86.68,28.91 86.6,28.91 80.58,34.93 | 80.43,35.08 80.58,34.93 | R57.1 89.23,28.07 R5.2 | v84.92,27.27 85.72,28.07 R57.1 | FADER2.1 95.63,78.76 94.52,79.87 92.78,79.87 91.67,78.76 FADER3.1 80.63,78.76 79.52,79.87 77.78,79.87 76.67,78.76 FADER4.1 65.63,78.76 64.52,79.87 62.78,79.87 61.67,78.76 FADER5.1 51.47,78.76 49.93,80.3 47.63,80.3 46.09,78.76 FADER6.1 | IC6.16 28.43,38.75 C36.1 31.86,39.59 31.86,39.67 32.93,40.74 v36.06,40.74 | v52.62,59.95 52.62,59.27 | 52.62,59.27 v52.62,51.06 | v55.91,59.27 52.62,59.27 | C26.+ 59.51,35.08 | 59.51,35.08 JP2.12 | 59.51,35.08 57.42,33 SW1.4 | 80.58,34.93 62.3,34.93 JP2.11
  Bottom 0.406: JP2.11 JP2.12 | v52.92,41.27 52.92,43.27 | 52.92,43.27 52.92,47.11 52.62,47.41 v52.62,51.06 | v52.62,59.95 v52.62,69.27 52.62,77.65 FADER5.1 | FADER8.1 16.67,78.76 17.78,79.87 19.52,79.87 20.63,78.76 FADER7.1 31.67,78.76 32.78,79.87 34.52,79.87 35.63,78.76 FADER6.1 | FADER2.1 106.67,78.76 107.78,79.87 109.52,79.87 110.63,78.76 FADER1.1 | ISP1.2 59.87,59.27 v55.91,59.27 | 52.92,43.27 44.31,43.27 41.78,40.74 v36.06,40.74 | SW1.4 58.61,16.06 59.56,17.02 60.36,17.02 61.31,16.06 SW1.3 | RATE.P$1 92.46,12.72 92.45,12.73 92.45,19.74 v84.92,27.27
+12V  (via drill 0.51)
  Top 0.406: D1.C 70.61,40.36 C4.+ 71.69,41.27 v74.92,41.27 | v105.12,68.84 106.17,67.79 106.17,67.7 106.41,67.46 107.11,67.46 IC3.4 109.87,66.9 C27.1 | v110.92,43.27 110.92,42.13 113.53,39.52 113.53,9.02 107.17,2.66 105.92,1.41 98.26,1.41 98.03,1.18 8.71,1.18 8.36,1.53 7.65,1.53 5.93,3.24 v5.93,5.27 C31.1 6.28,11.08 IC2.4 | v14.79,67.72 15.78,66.74 IC4.4 17.85,66.18 18.55,66.18 18.56,66.16 C29.1
  Bottom 0.406: v74.92,41.27 90.41,41.27 90.86,41.71 109.36,41.71 v110.92,43.27 110.92,46.57 110.08,47.41 110.08,51.27 111.09,52.28 111.09,62.87 v105.12,68.84 | v5.93,5.27 5.93,41.5 1.62,45.82 1.62,69.79 3.2,71.38 11.14,71.38 v14.79,67.72
-12V  (via drill 0.51)
  Top 0.406: D2.A 66.17,16.2 C5.- 66.17,8.52 v64.92,7.27 68.88,3.31 73.67,3.31 74.54,4.18 75.3,4.18 76.21,3.27 106.92,3.27 112.92,9.27 112.92,39.27 v106.92,45.27 | v18.92,13.27 18.92,11.34 C32.2 15.04,11.22 IC2.11 | v9.87,67.88 9.87,66.4 C30.2 10.21,66.74 IC4.11 | v104.48,66.77 102.6,66.77 IC3.11 100.06,66.9 C28.2 | v9.87,25.27 v9.87,45.27
  Bottom 0.406: v64.92,7.27 33.61,7.27 33.02,7.87 24.32,7.87 v18.92,13.27 16.22,15.97 16.22,17.54 15.48,18.28 14.92,18.28 9.87,23.33 v9.87,25.27 | v9.87,45.27 v9.87,67.88 | v104.48,66.77 104.48,59.15 104.02,58.68 104.02,48.17 v106.92,45.27
A  (via drill 0.51)
  Top 0.203: IC5.15 58.34,62.05 57.57,61.28 57.57,54.91 58.23,54.25 59.15,54.25 60.27,55.37 ISP1.4 | IC6.11 22.7,37.99 22.7,37.56 23.69,36.57 37.53,36.57 43.37,30.74 43.37,28.47 44.76,27.08 53.37,27.08 55.59,29.31 v55.59,33.75
  Bottom 0.203: ISP1.4 60.52,54.66 60.52,54.08 59.81,53.37 59.81,52.37 59.15,51.71 57.86,51.71 55.26,49.11 55.26,47.45 55.59,47.12 v55.59,33.75
B  (via drill 0.51)
  Top 0.203: ISP1.1 58.91,58.12 IC5.16 | IC6.10 21.43,37.99 21.43,37.56 23.01,35.97 35.29,35.97 44.59,26.68 53.54,26.68 56,29.14 56,30.81 v56.4,31.21
  Bottom 0.203: ISP1.1 56.56,55.78 55.67,55.78 54.78,54.88 54.78,33.42 56.4,31.79 v56.4,31.21
C  (via drill 0.51)
  Top 0.203: ISP1.3 60.11,56.79 60.11,58.37 61.02,59.28 IC5.17 | IC6.9 20.16,39.36 20.16,39.79 21.23,40.86 26.05,40.86 27.68,42.49 27.68,45.53 30.17,48.02 30.17,51.06 30.35,51.24 37.61,51.24 40.26,48.59 40.26,47.45 40.44,47.27 42.1,47.27 44.51,49.68 47.63,49.68 47.65,49.7 54.71,49.7 55.91,50.9 v55.91,54.87
  Bottom 0.203: v55.91,54.87 56.41,55.37 ISP1.3
CLK_IN  (via drill 0.51)
  Top 0.203: T1.3 92.85,29.07 R5.1 92.85,32.26 91.92,33.18 91.92,34.33 90.77,35.48 89.62,35.48 v82.92,42.18 | v79.56,45.34 65.43,59.47 v65.43,62.33 | v62.26,73.12 61.02,71.88 IC5.32
  Bottom 0.203: v82.92,42.18 79.76,45.34 v79.56,45.34 | v62.26,73.12 62.12,72.98 62.12,65.84 62.44,65.52 62.44,65.33 v65.43,62.33
CLK_OUT  (via drill 0.51)
  Top 0.203: IC2.10 14.24,10.48 13.68,10.48 13,11.15 13,24.33 16.12,27.44 16.12,32.42 11.23,37.31 11.23,46.48 10.26,47.45 10.26,49.11 10.44,49.29 12.1,49.29 14.12,47.27 22.02,47.27 22.31,47.56 22.31,49.28 27.99,54.95 35.17,54.95 35.89,54.23 v40.19,54.23 | v50.19,62.17 54.72,66.7 56.21,66.7 56.21,67.11 56.68,67.58 57.36,67.58 57.83,67.11 57.83,66.7 61.26,66.7 61.75,66.21 61.75,64.87 61.3,64.42 61.04,64.42 60.99,64.37 59.23,64.37 IC5.14
  Bottom 0.203: v40.19,54.23 41.6,55.64 43.07,55.64 49.6,62.17 v50.19,62.17
G0  (via drill 0.51)
  Top 0.203: IC3.3 107.01,64.96 106.45,64.96 106.27,64.78 106.27,62.66 106.47,62.46 R19.2 106.47,60.38 107.53,59.32 107.53,58.52 | 107.53,58.52 107.53,57.77 107.35,57.59 72,57.59 IC5.23 | FADER1.A 112.25,75.16 112.8,75.16 112.98,74.98 112.98,74.43 116.7,70.71 117.57,70.71 117.75,70.53 117.75,69.7 117.82,69.63 117.82,63.62 117.57,63.36 117.33,63.36 v116.92,62.96 | v116.71,60.58 114.64,58.52 107.53,58.52
  Bottom 0.203: v116.92,62.96 116.92,60.79 v116.71,60.58
G1  (via drill 0.51)
  Top 0.203: IC3.5 107.01,68.83 106.45,68.83 106.27,69.01 106.27,71.13 106.47,71.34 R24.2 106.47,73.54 107.53,74.59 107.53,76.15 106.66,77.01 95.4,77.01 FADER2.A | IC5.24 81.4,65.74 v90.92,75.27
  Bottom 0.203: v90.92,75.27 90.92,76.03 FADER2.A
G2
  Top 0.203: IC3.10 103.14,68.83 103.7,68.83 103.88,69.01 103.88,71.13 103.46,71.56 R29.2 100.32,76.61 95.23,76.61 94.09,77.75 80.93,77.75 79.92,78.76 78.92,78.76 FADER3.A 77.38,78.76 76.88,78.25 75.37,78.25 IC5.25
G3  (via drill 0.51)
  Top 0.203: IC3.12 103.14,64.96 103.7,64.96 103.88,64.78 103.88,62.66 103.46,62.24 R34.2 102.11,60.45 100.12,58.46 77.73,58.46 v72.92,63.27 | IC5.26 64.41,68.73 64.8,69.11 64.8,77.61 FADER4.A 63.65,78.54 v68.92,73.27
  Bottom 0.203: v72.92,63.27 68.92,67.27 v68.92,73.27
G4
  Top 0.203: IC4.3 16.62,64.8 16.06,64.8 15.88,64.63 15.88,62.5 16.46,61.92 16.46,61.27 | R39.2 16.46,61.27 | 16.46,61.27 16.51,61.27 19.02,58.76 27.63,58.76 43.79,74.91 44.8,74.91 FADER5.A 50.17,78.76 52.41,76.53 55.22,76.53 60.06,71.68 60.06,68.45 60.97,67.55 62.1,67.55 63.54,68.99 IC5.27
G5
  Top 0.203: IC4.5 16.62,68.67 16.06,68.67 15.88,68.85 15.88,70.98 16.46,71.56 R44.2 22.45,79.77 26.95,79.77 32.35,85.17 34.1,85.17 34.73,84.55 34.73,83.67 33.65,82.59 FADER6.A 36.89,78.76 37.9,77.75 45.8,77.75 47.84,79.79 49.72,79.79 52.57,76.93 62.26,76.93 63.66,75.53 63.66,70.24 63.28,69.86 IC5.28
G6  (via drill 0.51)
  Top 0.203: IC4.10 12.75,68.67 13.31,68.67 13.49,68.85 13.49,70.98 13.13,71.33 R49.2 13.13,73.86 12.07,74.91 12.07,76.46 12.25,76.64 16.53,76.64 FADER7.A | v39.11,69.08 39.11,61.08 40.92,59.27 48.92,59.27 52.93,63.28 55.87,63.28 IC5.12
  Bottom 0.203: FADER7.A 28.33,69.08 v39.11,69.08
G7
  Top 0.203: IC4.12 12.75,64.8 13.31,64.8 13.49,64.63 13.49,62.5 13.13,62.14 R54.2 | FADER8.A 3.65,77.11 1.37,74.83 1.37,62.58 5.9,58.04 10.72,58.04 R54.2 | R54.2 13.13,60.38 12.07,59.32 12.07,57.77 12.25,57.59 48.92,57.59 54.06,62.73 56.46,62.73 IC5.13
GND  (via drill 0.35)  (1 unrouted)
  other vias: 116.92,67.27 113.78,66.45 104.85,75.32 104.85,58.34 96.12,66.75 93.27,66.91 110.25,52.62 93.9,54.69 78.82,54.69 67.07,53.89 45.16,45.95 31.19,52.46 18.65,55.16 35.32,38.65 3.89,55 14.84,58.34 2.94,67.07 6.11,66.43 24.05,66.43 26.59,67.07 14.84,75.8 20.72,45.32 2.14,11.03 24.37,4.2 20.56,13.25 28.18,11.19 50.88,13.41 57.23,8.65 73.1,11.82 63.42,42.46 81.68,39.92 91.2,40.88 53.99,75.78 51.13,73.56 47.8,70.38 47.8,68 55.58,70.54 63.2,66.41 51.3,29.14
  pour Top: 119.92,100 0,100 0,0 119.92,0
  pour Bottom: 119.92,100 0,100 0,0 119.92,0
N$1
  Top 0.203: IC5.7 55.12,68.81 53.31,68.81 52.95,68.46 52.28,68.46 51.81,68.93 51.81,69.87 C1.1 48.91,71.94 Q1.2
N$2
  Top 0.203: IC5.8 53.26,66.17 C2.1 48.76,66.17 Q1.1
N$3
  Top 0.203: R60.1 17,33.37 17,27.27 | R62.2 17,27.27 | IC2.12 14.24,13.02 13.68,13.02 13.5,13.2 13.5,20.2 14.86,21.56 15.77,21.56 17,22.79 17,27.27
N$4
  Top 0.203: R1.1 16.61,16.6 IC2.14 IC2.13
N$5
  Top 0.203: GLIDE.P$1 32.46,11.73 27.74,16.45 19.68,16.45 R1.2
N$6
  Top 0.203: FADER8.2 14.6,44.95 15.25,44.3 17.54,42.01 23.39,42.01 23.87,42.49 23.87,42.92 IC6.4
N$7
  Top 0.203: IC6.2 26.41,44.29 26.41,44.72 26.27,44.86 FADER7.2
N$8
  Top 0.203: FADER6.2 35,54.55 28.44,54.55 23.19,49.29 22.9,49.29 22.72,49.11 22.72,47.45 23.28,46.89 IC6.5
N$9
  Top 0.406: 67.36,32.54 D1.A 67.31,32.6 JP2.9
  Bottom 0.406: JP2.9 JP2.10
N$11
  Top 0.203: FADER5.2 55.57,48.28 54.56,47.27 50.36,47.27 49.66,47.97 49.66,49.11 49.48,49.29 47.82,49.29 47.8,49.27 45.71,49.27 41.33,44.9 29.43,44.9 28.36,43.83 IC6.1
N$12
  Top 0.203: FADER4.2 67.66,44.67 64.08,44.67 63.89,44.49 29.81,44.49 28.95,43.62 28.95,42.49 26.92,40.46 24.63,40.46 23.97,39.79 23.97,39.36 IC6.12
N$13
  Top 0.203: IC6.15 27.09,40.06 31.12,44.08 64.06,44.08 64.25,44.27 80.19,44.27 80.41,44.49 82.48,44.49 FADER3.2
N$14
  Top 0.203: FADER2.2 96.85,43.86 88.39,43.86 88.17,44.08 80.58,44.08 80.36,43.86 64.42,43.86 64.23,43.68 31.66,43.68 27.68,39.69 27.68,37.56 27.5,37.38 26.69,37.38 26.51,37.56 26.51,37.99 IC6.14
N$15
  Top 0.203: FADER1.2 114.07,46.08 106.58,46.08 103.77,43.27 88.41,43.27 88,43.68 80.75,43.68 80.34,43.27 72.42,43.27 72.24,43.46 64.59,43.46 64.4,43.27 38.92,43.27 37.18,41.52 37.18,39.47 34.68,36.97 25.82,36.97 25.24,37.56 25.24,37.99 IC6.13
N$16
  Top 0.203: C3.1 GLIDE.P$2 | IC2.3 10.79,12.35 12.09,11.05 12.09,6.1 14.92,3.27 16.5,3.27 17.07,2.7 20.52,2.7 20.76,2.94 22.11,2.94 22.39,3.21 26.65,3.21 GLIDE.P$2 | GLIDE.P$3 GLIDE.P$2
N$17
  Top 0.203: R6.1 R7.2 T1.1
N$18  (via drill 0.51)
  Top 0.203: IC2.5 9.04,9.15 8.48,9.15 8.3,8.97 8.3,8.68 7.01,7.4 7.01,3.59 8.92,1.68 97.82,1.68 v98.45,2.32 | v99.41,18.19 99.41,20.53 R61.2
  Bottom 0.203: v98.45,2.32 99.41,3.27 v99.41,18.19
N$19
  Top 0.203: R2.1 R3.2 5.14,13.28 C6.1 9.36,13.28 IC2.2
N$20
  Top 0.203: IC2.1 7.66,14.89 C6.2 6.57,15.98 R4.1
N$21
  Top 0.203: R2.2 4.67,17.25 R4.2 14.96,28.33 CV_OUT.TIP
N$22
  Top 0.203: R9.1 47.09,37.11 T2.1 47.1,37.12 R10.2
N$23
  Top 0.203: R9.2 44.96,34.81 RESET.TIP
N$24
  Top 0.203: IC2.9 17.18,8.54 C7.1 R11.2 22.13,6.14 R12.1
N$25
  Top 0.203: IC2.8 15.88,6.3 C7.2 17.85,5.98 R13.2
N$26
  Top 0.203: R61.1 104.96,27.98 CLK_IN.TIP 104.72,28.76 R6.2
N$27
  Top 0.203: IC2.6 IC2.7 9.7,4.75 R14.2
N$28  (via drill 0.51)
  Top 0.203: v74.92,3.27 74.46,2.81 22.56,2.81 22.28,2.53 20.92,2.53 20.69,2.29 16.9,2.29 16.39,2.81 R14.1 | v76.92,7.27 76.92,26.56 CLOCK_OUT.TIP
  Bottom 0.203: v74.92,3.27 76.92,5.27 v76.92,7.27
N$29  (via drill 0.51)
  Top 0.203: R11.1 19.75,5.98 R13.1 19.75,3.75 v21.78,3.75 | CLK_IN.NORM 94.33,9.38 94.33,6.45 93.15,5.27 86.94,5.27 86.72,5.5 73.56,5.5 73.23,5.83 72.56,5.83 71.74,5.02 v70.51,5.02
  Bottom 0.203: v21.78,3.75 23.79,3.75 24.06,3.47 68.96,3.47 v70.51,5.02
N$30  (via drill 0.51)
  Top 0.203: IC5.22 65.32,63.14 65.77,63.14 74.92,53.99 v74.92,51.27 | v72.92,33.27 89.96,16.23 RATE.P$2
  Bottom 0.203: v74.92,51.27 74.92,45.27 72.92,43.27 v72.92,33.27
N$31
  Top 0.203: FADER1.K 108.65,50.41 R15.1
N$32
  Top 0.203: IC3.2 107.73,64.42 C10.1 R16.1 R17.2
N$33
  Top 0.203: IC3.1 109.55,63.09 C10.2 R18.1
N$34
  Top 0.203: R18.2 112.35,60.45 R16.2 116.21,62.52 116.58,62.14 117.26,62.14 117.73,62.62 117.73,62.96 118.23,63.45 118.23,70.63 117.75,71.11 117.75,76.59 114.56,79.77 113.11,79.77 D3.A
N$35
  Top 0.203: FADER3.K 78.85,48.48 R25.1
N$36
  Top 0.203: FADER2.K 93.65,50.64 R20.1
N$37
  Top 0.203: R22.2 R21.1 C12.1 109.9,69.44 IC3.6
N$38
  Top 0.203: IC3.7 108.53,71.56 C12.2 R23.1
N$39
  Top 0.203: R21.2 112.35,73.78 R23.2 108.38,77.75 107.82,77.75 101.36,84.21 D4.A
N$40
  Top 0.203: R27.2 R26.1 C14.1 102.25,69.66 IC3.9
N$41
  Top 0.203: R28.1 C14.2 101.62,71.56 IC3.8
N$42  (via drill 0.51)
  Top 0.203: R26.2 97.74,73.78 R28.2 96.92,75.24 v96.92,75.27
  Bottom 0.203: v96.92,75.27 96.92,79.27 91.85,84.34 D5.A
N$43
  Top 0.203: FADER4.K 65.2,49.83 R30.1
N$44
  Top 0.203: IC3.13 102.42,64.42 C16.1 R31.1 R32.2
N$45
  Top 0.203: IC3.14 100.54,63.09 C16.2 R33.1
N$46  (via drill 0.51)
  Top 0.203: R31.2 97.74,60.45 R33.2 97.2,59.27 v94.92,59.27
  Bottom 0.203: D6.A 75.82,84.37 80.42,79.77 94.48,79.77 94.66,79.59 94.66,79.53 94.92,79.27 v94.92,59.27
N$47
  Top 0.203: R35.1 48.65,46.52 FADER5.K
N$48
  Top 0.203: IC4.2 19.7,64.2 C18.1 R36.1 R37.2
N$49
  Top 0.203: R38.1 C18.2 19.07,62.93 IC4.1
N$50  (via drill 0.51)
  Top 0.203: R38.2 22.02,60.13 R36.2 27.85,62.2 v40.92,75.27
  Bottom 0.203: v40.92,75.27 40.92,76.63 D7.A
N$51
  Top 0.203: R40.1 33.54,48.39 FADER6.K
N$52
  Top 0.203: IC4.6 19.42,69.28 C20.1 R41.1 R42.2
N$53
  Top 0.203: R43.1 C20.2 18.29,71.56 IC4.7
N$54
  Top 0.203: R41.2 22.02,73.62 R43.2 31.86,84.11 D8.A
N$55
  Top 0.203: R45.1 18.69,48.31 FADER7.K
N$56
  Top 0.203: IC4.9 10.02,69.28 C22.1 R46.1 R47.2
N$57
  Top 0.203: R48.1 C22.2 11.07,71.56 IC4.8
N$58
  Top 0.203: R46.2 7.41,73.62 R48.2 17.93,84.14 D9.A
N$59
  Top 0.203: R50.1 3.92,48.55 FADER8.K
N$60
  Top 0.203: R52.2 R51.1 C24.1 12.03,64.26 IC4.13
N$61
  Top 0.203: IC4.14 10.21,62.93 C24.2 R53.1
N$62
  Top 0.203: R53.2 7.26,60.45 R51.2 6.65,62.96 1.93,62.96 1.77,63.12 1.77,74.66 D10.A
N$63  (via drill 0.51)
  Top 0.203: IC5.2 58.34,70.94 58.73,70.56 58.73,69.73 v58.11,69.11 | v59.72,80.42 61.62,82.33 96.86,82.33 100.36,85.82 109.88,85.82 119.09,76.61 119.09,17.44 v114.92,13.27 | v110.92,13.27 101.72,4.07 76.14,4.07 75.51,4.69 74.33,4.69 73.7,4.07 70.19,4.07 v68.29,5.97 | SW1.1 62.5,10.35 R55.2 58.69,10.98 SW1.2
  Bottom 0.203: v59.72,80.42 58.11,78.81 58.11,73.62 58.78,72.94 58.78,72.27 58.11,71.59 v58.11,69.11 | v114.92,13.27 v110.92,13.27 | v68.29,5.97 63.28,10.98 SW1.1
N$64  (via drill 0.51)
  Top 0.203: IC5.9 55.25,65.74 55.64,66.13 56.38,66.13 v57.02,66.77 | v62.1,80.9 62.89,81.69 97.02,81.69 100.68,85.35 109.03,85.35 109.56,85.35 118.15,76.76 118.15,71.28 118.63,70.8 118.63,63.28 118.14,62.79 118.14,17.72 115.69,15.27 v114.92,15.27 | v72.89,5.02 74.08,5.02 74.16,5.1 75.68,5.1 75.91,4.87 100.53,4.87 v110.84,15.18
  Bottom 0.203: v57.02,66.77 59.19,68.94 59.19,73.11 59.08,73.22 59.08,77.88 v62.1,80.9 | v114.92,15.27 110.93,15.27 v110.84,15.18 | v72.89,5.02 64.39,13.52 SW1.A
N$65
  Top 0.203: R56.2 SW1.K
N$66
  Top 0.203: R57.2 89.96,32.4 DIRSW.2
N$67  (via drill 0.51)
  Top 0.203: DIRSW.1 94.66,33.64 R58.2 86.07,42.22 v86.07,42.46 | v76.07,46.45 65.62,56.9 65.62,56.94 64.48,58.08 v64.48,61.22 | v60.99,65.19 59.73,65.19 59.73,65.61 59.26,66.08 58.58,66.08 58.18,65.68 56.01,65.68 IC5.10
  Bottom 0.203: v86.07,42.46 81.92,46.61 76.23,46.61 v76.07,46.45 | v60.99,65.19 64.48,61.69 v64.48,61.22
N$68  (via drill 0.51)
  Top 0.203: DIRSW.3 82.99,35.79 R59.2 78.92,38.74 78.92,41.27 80.92,43.27 87.83,43.27 v88.92,42.18 | IC5.11 56.73,65.27 v58.92,65.27 | v86.92,55.27 90.92,51.27 v90.92,45.27
  Bottom 0.203: v86.92,55.27 69.73,72.46 69.73,73.61 69.26,74.08 68.58,74.08 68.1,73.6 63.69,73.6 62.02,75.27 60.92,75.27 59.6,73.95 59.6,68.78 58.92,68.1 v58.92,65.27 | v90.92,45.27 90.92,44.18 v88.92,42.18
N$69
  Top 0.203: IC6.3 25.14,42.92 25.14,42.49 23.92,41.27 13.56,41.27 R60.2
N$70
  Top 0.203: RANGE.2 25.87,29.43 R62.1
N$71
  Top 0.203: GATE4.TIP 67.46,96.29 65.5,94.33 65.5,86.17 D6.C
N$72
  Top 0.203: GATE3.TIP 82.46,96.29 80.5,94.33 80.5,86.37 D5.C
N$73
  Top 0.203: D4.C 93.55,94.61 GATE2.TIP
N$74
  Top 0.203: D3.C 116.22,94.77 GATE1.TIP
N$75
  Top 0.203: GATE8.TIP 7.46,96.29 5.5,94.33 5.5,86.01 D10.C
N$76
  Top 0.203: D9.C 25.89,95.09 GATE7.TIP
N$77
  Top 0.203: D8.C 41.29,94.69 GATE6.TIP
N$78
  Top 0.203: D7.C 56.05,94.93 GATE5.TIP
N$79
  Top 0.406: 67.08,22.38 D2.C 62.44,22.09 JP2.1
  Bottom 0.406: JP2.1 JP2.2
N$81
  Bottom 0.406: JP2.13 JP2.14
N$82
  Bottom 0.406: JP2.15 JP2.16
RESET  (via drill 0.51)
  Top 0.203: T2.3 48.21,40.93 R8.1 44.66,39.27 v42.92,39.27 | v42.92,49.27 42.92,56.27 v42.73,56.45 | v41.62,60.58 41.46,60.74 v41.46,70.9 | v57.97,72.61 58.76,71.81 IC5.1
  Bottom 0.203: v42.92,39.27 42.27,39.92 35.73,39.92 35.25,40.4 35.25,41.07 35.73,41.55 36.38,41.55 42.92,48.09 v42.92,49.27 | v42.73,56.45 42.73,59.47 v41.62,60.58 | v41.46,70.9 48.31,77.75 49.48,77.75 52.16,80.42 57.97,80.42 57.97,79.25 57.7,78.98 57.7,73.25 57.97,72.98 v57.97,72.61
RST  (via drill 0.51)
  Top 0.203: v61.3,68.36 62.33,69.38 62.33,69.43 62.71,69.81 IC5.29
  Bottom 0.203: ISP1.5 60.11,54.25 60.11,55.83 61.07,56.79 61.69,56.79 62.35,57.45 62.35,58.37 61.22,59.5 61.22,63.27 60.53,63.96 60.53,64.57 60.23,64.87 60.23,65.5 60.67,65.95 61.23,65.95 61.3,66.02 v61.3,68.36

### Text on the board
tPlace: Pure Seq V2.3 / cc-by 4.0 2021 / The Little Red Hen | U5 | T2 | T1
bPlace: FADER8 | FADER7 | FADER4 | FADER3 | FADER2 | FADER1 | FADER6 | FADER5 | SLEW | RATE | PLAYPAUSESW